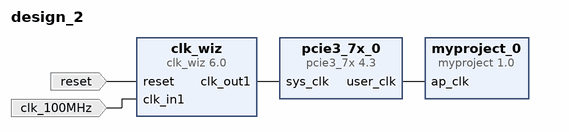
[diagram p0: block diagram of the top level]
# Vivado block design design_2, xc7vx690tffg1761-2, Vivado 2018.3
create_bd_design design_2

create_bd_port -dir I -type rst reset
set_property -dict {CONFIG.POLARITY ACTIVE_HIGH} [get_bd_ports reset]
create_bd_port -dir I -type clk clk_100MHz
set_property -dict {CONFIG.FREQ_HZ 100000000} [get_bd_ports clk_100MHz]

create_bd_cell -type ip -vlnv xilinx.com:hls:myproject:1.0 myproject_0
create_bd_cell -type ip -vlnv xilinx.com:ip:pcie3_7x:4.3 pcie3_7x_0
create_bd_cell -type ip -vlnv xilinx.com:ip:clk_wiz:6.0 clk_wiz
set_property -dict {CONFIG.RESET_BOARD_INTERFACE reset CONFIG.USE_BOARD_FLOW true} [get_bd_cells clk_wiz]

# ---- connections ----

connect_bd_net [get_bd_pins clk_wiz/clk_out1] [get_bd_pins pcie3_7x_0/sys_clk]
connect_bd_net [get_bd_ports reset] [get_bd_pins clk_wiz/reset]
connect_bd_net [get_bd_ports clk_100MHz] [get_bd_pins clk_wiz/clk_in1]
connect_bd_net [get_bd_pins pcie3_7x_0/user_clk] [get_bd_pins myproject_0/ap_clk]

validate_bd_design
save_bd_design
